# EAGLE design H_BoardV1.1 (EAGLE 5.06)
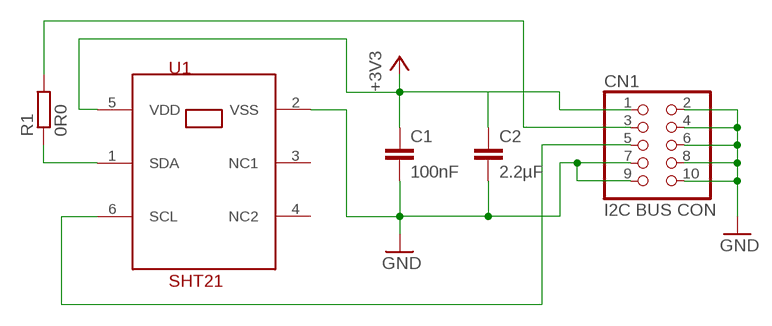
[diagram p0: schematic, sheet 1]

## Parts
C1  100nF  C-EUC0805  [C0805]
C2  2.2µF  C-EUC0805  [C0805]
CN1  I2C BUS CON  PIN1.27-2X5-2  [1X02-SMD1.27MM]
R1  0R0  R-EU_R1206  [R1206]
U1  SHT21  [DFN3X3]

## Nets
+3V3: C1.1 C2.1 CN1.1 U1.5(VDD)
GND: C1.2 C2.2 CN1.2 CN1.4 CN1.6 CN1.7 CN1.8 CN1.9 CN1.10 U1.2(VSS)
N$1: CN1.3 R1.2
N$2: R1.1 U1.1(SDA)
N$3: CN1.5 U1.6(SCL)
Unconnected: U1.3(NC1) U1.4(NC2)

## Library data of the parts
C1 C2 = rcl:C-EU: CAPACITOR, European symbol
CN1 = my_lib:PIN1.27-2X5-: HARWIN Female-to-Male IDC Ribbon Cable Assembly 1.27mm Pitch DIL 10 Contacts, 2 rows
R1 = rcl:R-EU_: RESISTOR, European symbol
U1 = my_lib:SHT21

## Board
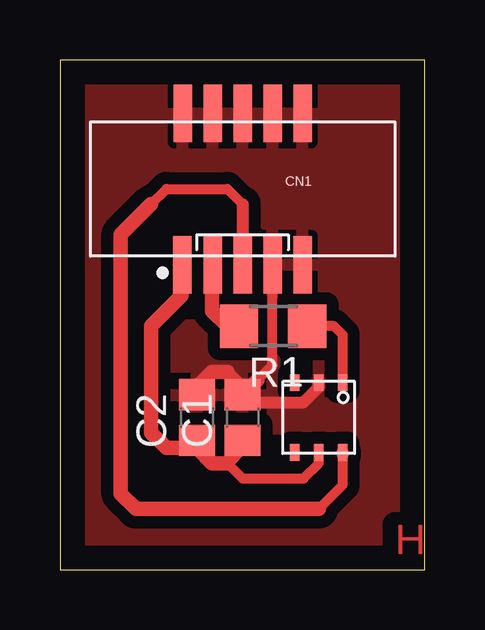
[diagram p1: board, top side]

Size 15.22 x 21.26 mm. Coordinates in mm from the lower left corner, seen from the top.
Outline: 0,0 15.22,0 15.22,21.26 0,21.26 0,0
Copper layers (1*16): Top 0.035mm / dielectric 1.5mm / Bottom 0.035mm
Design rules "default": minimum track width 10mil, minimum drill 24mil, track to track 8mil, track to pad 8mil, pad to pad 8mil, via to via 8mil, smd to smd 8mil, copper to edge 40mil, drill to drill 8mil, minimum pad ring 10mil, minimum via ring 8mil, stop-mask expansion 4mil, vias tented up to drill 0mil, thermal gap 10mil

### Footprints (pad centres in the part's own frame; a part is rotated, then mirrored left to right if it is on the bottom)
C0805 = smd 1.3 x 1.5: 1 -0.95,0; 2 0.95,0
1X02-SMD1.27MM = smd 0.76 x 2.4: 1 -2.52,-3.15; 2 -2.5,3.15; 3 -1.25,-3.15; 4 -1.25,3.15; 5 0,-3.15; 6 0,3.15; 7 1.25,-3.15; 8 1.25,3.15; 9 2.5,-3.15; 10 2.5,3.15
R1206 = smd 1.6 x 1.803: 1 -1.422,0; 2 1.422,0
DFN3X3 = smd 0.4 x 0.7: 1 -1,-1.45; 2 0,-1.45; 3 1,-1.45; 4 1,1.45; 5 0,1.45; 6 -1,1.45

### Placement (x,y rotation side)
C1  7.62,6.35 90 top
C2  5.71,6.35 90 top
CN1  7.62,15.88 0 top
R1  8.89,10.16 180 top
U1  10.79,6.35 180 top

### Tracks (layer width: path | path; a pad name or v marks a point on that pad's centre or on a via)
+3V3
  Top 0.406: U1.5 10.79,4.45 10.16,3.81 7.62,3.81 6.99,4.45
  Top 0.508: 6.99,4.45 7.62,5.08 C1.1
  Top 0.61: 6.99,4.45 6.35,4.45 5.71,5.08 C2.1 5.39,5.08 4.45,5.08 3.81,5.71 3.81,10.16 5.08,11.43 5.08,12.71 CN1.1 5.1,12.09
GND
  Top 0.406: CN1.7 8.87,8.55 8.23,7.92
  Top 0.508: 6.99,8.26 7.62,7.62 C1.2 7.93,6.99 10.16,6.99 10.79,7.62 U1.2
  Top 0.61: C1.2 8.23,7.92 | 6.99,8.26 6.35,8.26 5.71,7.62 C2.2
  pour Top (isolate 0.508): 0,20.95 15.24,20.95 15.24,0 0,0
N$1
  Top 0.61: R1.2 6.99,10.16 6.35,10.79 6.35,12.71 CN1.3
N$2
  Top 0.406: U1.1 11.79,9.79 11.43,10.16 R1.1
N$3
  Top 0.406: 3.81,15.24 4.45,15.88 6.99,15.88 7.62,15.24 | U1.6 11.79,3.54 10.79,2.54
  Top 0.508: U1.6 11.79,4.81 | 7.62,15.24 CN1.5
  Top 0.61: 10.79,2.54 3.17,2.54 2.54,3.17 2.54,13.97 3.81,15.24

### Text on the board
Top: H